# EAGLE design PCB-BI8-2x4C3 (EAGLE 7.5.0)

## Sheet 1 of 2
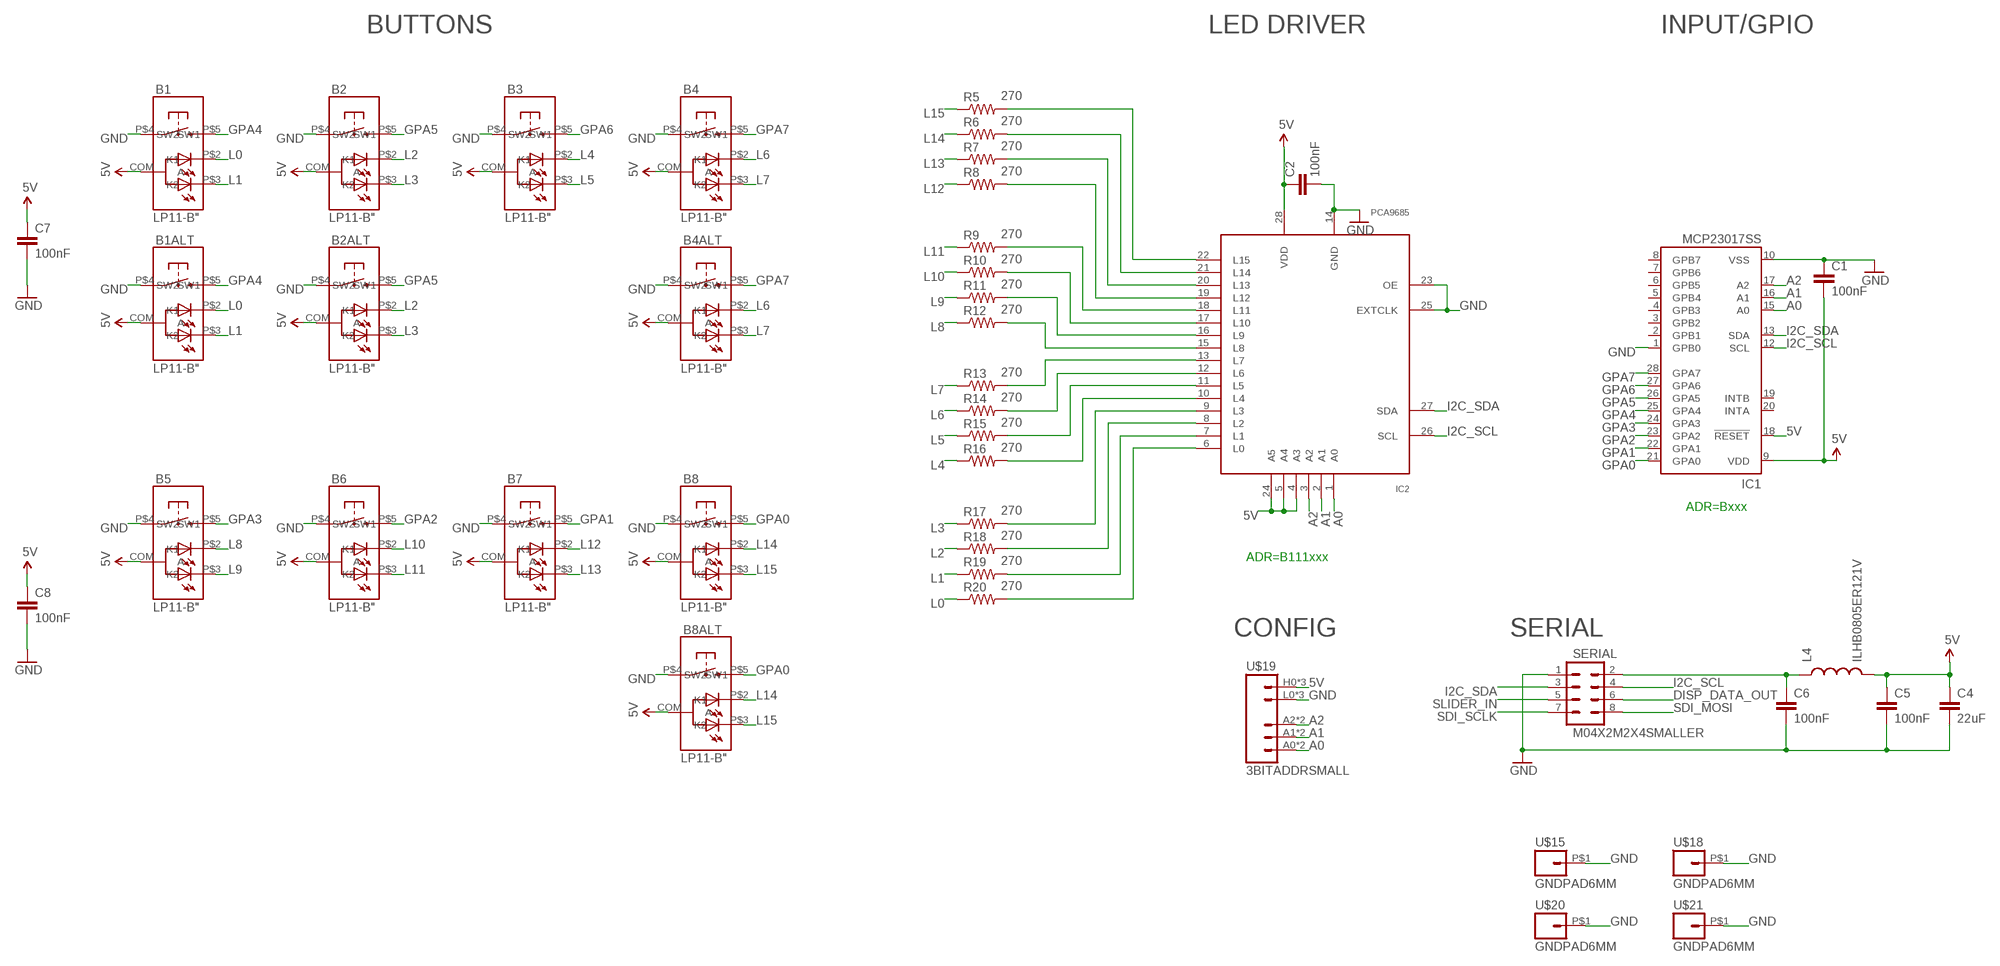
[diagram p0: schematic, sheet 1]

### Parts
B1  LP11-B"  [LP11]
B1ALT  LP11-B"  [LP11]
B2  LP11-B"  [LP11]
B2ALT  LP11-B"  [LP11]
B3  LP11-B"  [LP11]
B4  LP11-B"  [LP11]
B4ALT  LP11-B"  [LP11]
B5  LP11-B"  [LP11]
B6  LP11-B"  [LP11]
B7  LP11-B"  [LP11]
B8  LP11-B"  [LP11]
B8ALT  LP11-B"  [LP11]
C1  100nF  CAP0603-CAP  [0603-CAP]
C2  100nF  CAP0603-CAP  [0603-CAP]
C4  22uF  CAP0805  [0805]
C5  100nF  CAP0603-CAP  [0603-CAP]
C6  100nF  CAP0603-CAP  [0603-CAP]
C7  100nF  CAP0603-CAP  [0603-CAP]
C8  100nF  CAP0603-CAP  [0603-CAP]
IC1  MCP23017SS  [SSOP28]
IC2  PCA9685  [TSSOP28]
L4  ILHB0805ER121V  INDUCTOR0805  [0805]
R5  270  RESISTOR0603-RES  [0603-RES]
R6  270  RESISTOR0603-RES  [0603-RES]
R7  270  RESISTOR0603-RES  [0603-RES]
R8  270  RESISTOR0603-RES  [0603-RES]
R9  270  RESISTOR0603-RES  [0603-RES]
R10  270  RESISTOR0603-RES  [0603-RES]
R11  270  RESISTOR0603-RES  [0603-RES]
R12  270  RESISTOR0603-RES  [0603-RES]
R13  270  RESISTOR0603-RES  [0603-RES]
R14  270  RESISTOR0603-RES  [0603-RES]
R15  270  RESISTOR0603-RES  [0603-RES]
R16  270  RESISTOR0603-RES  [0603-RES]
R17  270  RESISTOR0603-RES  [0603-RES]
R18  270  RESISTOR0603-RES  [0603-RES]
R19  270  RESISTOR0603-RES  [0603-RES]
R20  270  RESISTOR0603-RES  [0603-RES]
SERIAL  M04X2M2X4SMALLER  [M2X4SMALLER]
U$15  GNDPAD6MM  [3.2MMPAD6MM]
U$18  GNDPAD6MM  [3.2MMPAD6MM]
U$19  3BITADDRSMALL  [3BITADDR_SMALL]
U$20  GNDPAD6MM  [3.2MMPAD6MM]
U$21  GNDPAD6MM  [3.2MMPAD6MM]

### Nets
5V [Power]: B1.COM(A) B1ALT.COM(A) B2.COM(A) B2ALT.COM(A) B3.COM(A) B4.COM(A) B4ALT.COM(A) B5.COM(A) B6.COM(A) B7.COM(A) B8.COM(A) B8ALT.COM(A) C1.2 C2.1 C4.1 C5.1 C7.1 C8.1 IC1.9(VDD) IC1.18(!RESET) IC2.4(A3) IC2.5(A4) IC2.24(A5) IC2.28(VDD) L4.2 U$19.H0(VCC) U$19.H1(VCC) U$19.H2(VCC)
A0: IC1.15(A0) IC2.1(A0) U$19.A0 U$19.AS0(A0)
A1: IC1.16(A1) IC2.2(A1) U$19.A1 U$19.AS1(A1)
A2: IC1.17(A2) IC2.3(A2) U$19.A2 U$19.AS2(A2)
DISP_DATA_OUT: SERIAL.6
GND [Power]: B1.P$4(SW1) B1ALT.P$4(SW1) B2.P$4(SW1) B2ALT.P$4(SW1) B3.P$4(SW1) B4.P$4(SW1) B4ALT.P$4(SW1) B5.P$4(SW1) B6.P$4(SW1) B7.P$4(SW1) B8.P$4(SW1) B8ALT.P$4(SW1) C1.1 C2.2 C4.2 C5.2 C6.2 C7.2 C8.2 IC1.1(GPB0) IC1.10(VSS) IC2.14(GND) IC2.23(OE) IC2.25(EXTCLK) SERIAL.1 U$15.P$1 U$18.P$1 U$19.L0(GND) U$19.L1(GND) U$19.L2(GND) U$20.P$1 U$21.P$1
GPA0: B8.P$5(SW2) B8ALT.P$5(SW2) IC1.21(GPA0)
GPA1: B7.P$5(SW2) IC1.22(GPA1)
GPA2: B6.P$5(SW2) IC1.23(GPA2)
GPA3: B5.P$5(SW2) IC1.24(GPA3)
GPA4: B1.P$5(SW2) B1ALT.P$5(SW2) IC1.25(GPA4)
GPA5: B2.P$5(SW2) B2ALT.P$5(SW2) IC1.26(GPA5)
GPA6: B3.P$5(SW2) IC1.27(GPA6)
GPA7: B4.P$5(SW2) B4ALT.P$5(SW2) IC1.28(GPA7)
I2C_SCL: IC1.12(SCL) IC2.26(SCL) SERIAL.4
I2C_SDA: IC1.13(SDA) IC2.27(SDA) SERIAL.3
L0: B1.P$2(K1) B1ALT.P$2(K1) R20.1
L1: B1.P$3(K2) B1ALT.P$3(K2) R19.1
L2: B2.P$2(K1) B2ALT.P$2(K1) R18.1
L3: B2.P$3(K2) B2ALT.P$3(K2) R17.1
L4: B3.P$2(K1) R16.1
L5: B3.P$3(K2) R15.1
L6: B4.P$2(K1) B4ALT.P$2(K1) R14.1
L7: B4.P$3(K2) B4ALT.P$3(K2) R13.1
L8: B5.P$2(K1) R12.1
L9: B5.P$3(K2) R11.1
L10: B6.P$2(K1) R10.1
L11: B6.P$3(K2) R9.1
L12: B7.P$2(K1) R8.1
L13: B7.P$3(K2) R7.1
L14: B8.P$2(K1) B8ALT.P$2(K1) R6.1
L15: B8.P$3(K2) B8ALT.P$3(K2) R5.1
N$1 [Power]: C6.1 L4.1 SERIAL.2
N$4: IC2.13(L7) R13.2
N$5: IC2.12(L6) R14.2
N$7: IC2.11(L5) R15.2
N$9: IC2.10(L4) R16.2
N$10: IC2.9(L3) R17.2
N$11: IC2.8(L2) R18.2
N$12: IC2.7(L1) R19.2
N$19: IC2.6(L0) R20.2
N$20: IC2.15(L8) R12.2
N$21: IC2.16(L9) R11.2
N$22: IC2.17(L10) R10.2
N$23: IC2.18(L11) R9.2
N$24: IC2.19(L12) R8.2
N$25: IC2.20(L13) R7.2
N$26: IC2.21(L14) R6.2
N$27: IC2.22(L15) R5.2
SDI_MOSI: SERIAL.8
SDI_SCLK: SERIAL.7
SLIDER_IN: SERIAL.5
Unconnected: IC1.2(GPB1) IC1.3(GPB2) IC1.4(GPB3) IC1.5(GPB4) IC1.6(GPB5) IC1.7(GPB6) IC1.8(GPB7) IC1.19(INTB) IC1.20(INTA)

### Notes on the sheet
- BUTTONS | LED DRIVER | INPUT/GPIO
- ADR=Bxxx
- ADR=B111xxx
- CONFIG | SERIAL

## Sheet 2 of 2

## Library data of the parts
B1 B1ALT B2 B2ALT B3 B4 B4ALT B5-B8 B8ALT = SKAARHOJ:LP11-B
C1 C2 C4-C8 = SparkFun:CAP: Capacitor Standard 0603 ceramic capacitor, and 0.1" leaded capacitor.
IC1 = microchip:MCP23017: http://ww1.microchip.com/downloads/en/DeviceDoc/21952a.pdf Source: http://ww1.microchip.com/downloads/en/DeviceDoc/21952a.pdf; MF: MICROCHIP; MPN: MCP23017-E/SS; OC_FARNELL: 1467674; OC_NEWARK: 31K2960
IC2 = wsmith:PCA9685
L4 = SparkFun:INDUCTOR: Inductors Basic Inductor/Choke - 0603 and 1206. Footprints are not proven and vary greatly between part numbers.
R5-R20 = SparkFun:RESISTOR: Resistor Basic schematic elements and footprints for 0603, 1206, and PTH resistors.
SERIAL = SKAARHOJ:M04X2
U$15 U$18 U$20 U$21 = SKAARHOJ:GNDPAD
U$19 = SKAARHOJ:3BITADDR

## Net classes
0 default: width 0.203 mm, drill 0.406 mm, clearance 0.203 mm
1 Power: width 0.406 mm, drill 0.61 mm, clearance 0.203 mm

## Board
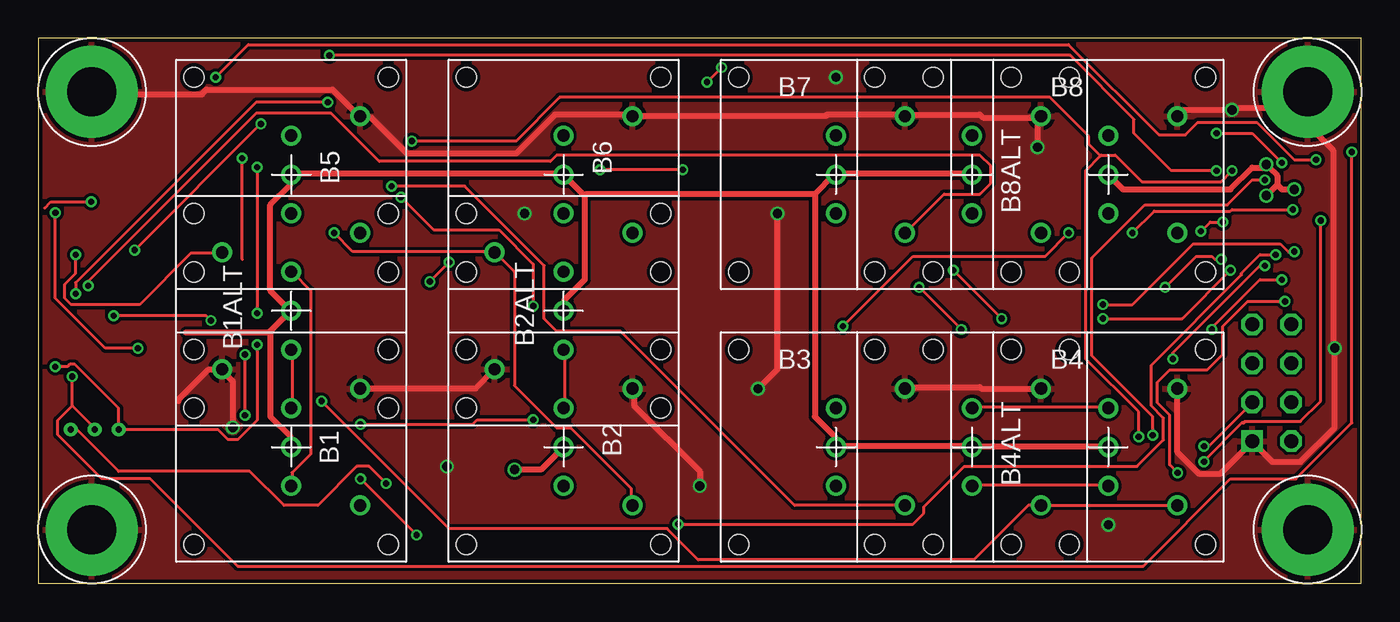
[diagram p1: board, top side]
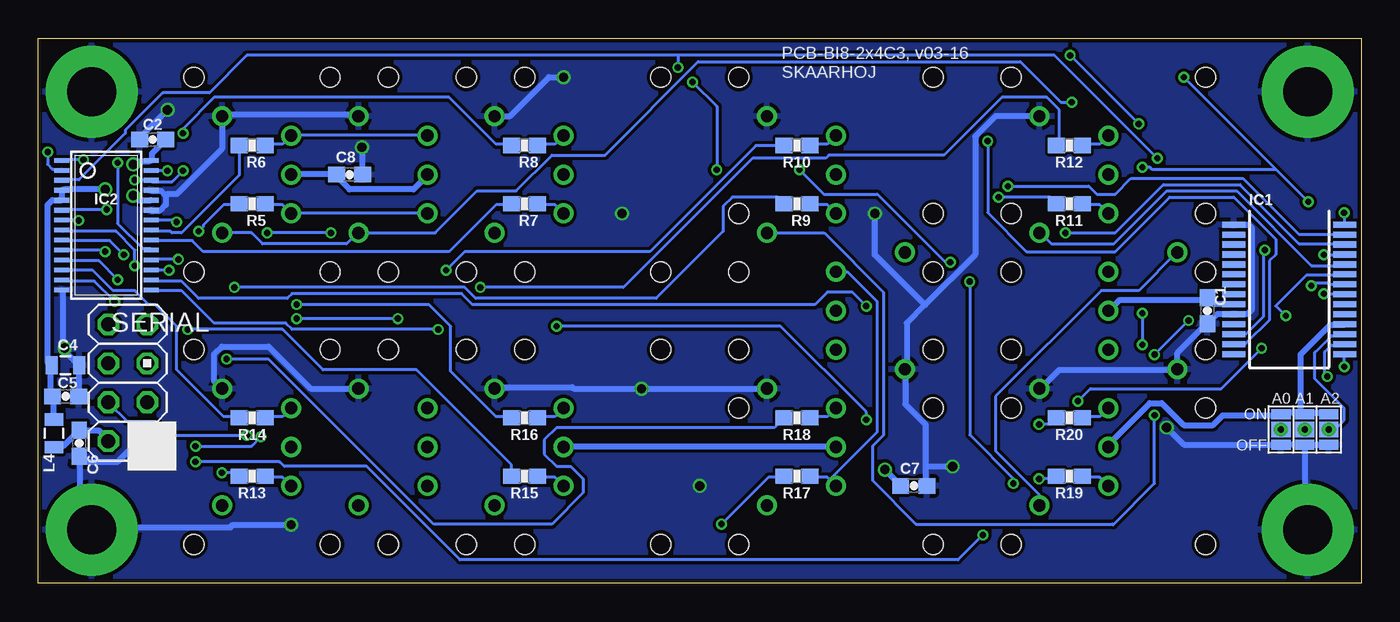
[diagram p2: board, bottom side, seen from below]

Size 86.36 x 35.56 mm. Coordinates in mm from the lower left corner, seen from the top.
Outline: 0,0 86.36,0 86.36,35.56 0,35.56 0,0
Copper layers (1*16): Top 0.035mm / dielectric 1.5mm / Bottom 0.035mm
Design rules "Fusion_eagle_rule_v1.1": minimum track width 6mil, minimum drill 12mil, track to track 6mil, track to pad 6mil, pad to pad 6mil, via to via 6mil, smd to smd 0mil, copper to edge 10mil, drill to drill 10mil, minimum pad ring 10mil, minimum via ring 6mil, stop-mask expansion 2mil, vias tented up to drill 100mil, thermal gap 10mil

### Footprints (pad centres in the part's own frame; a part is rotated, then mirrored left to right if it is on the bottom)
LP11 = drill 0.8: COM 0,0; P$2 0,2.54; P$3 0,-2.54; P$4 4.5,3.81; P$5 4.5,-3.81 | hole 1.3: -6.35,6.35; 6.35,6.35; 6.35,-6.35; -6.35,-6.35
0603-CAP = smd 1.1 x 1: 1 -0.85,0; 2 0.85,0
0805 = smd 0.8 x 1.2: 1 -0.9,0; 2 0.9,0
SSOP28 = smd 0.4 x 1.5: 1 -4.225,-3.625; 2 -3.575,-3.625; 3 -2.925,-3.625; 4 -2.275,-3.625; 5 -1.625,-3.625; 6 -0.975,-3.625; 7 -0.325,-3.625; 8 0.325,-3.625; 9 0.975,-3.625; 10 1.625,-3.625; 11 2.275,-3.625; 12 2.925,-3.625; 13 3.575,-3.625; 14 4.225,-3.625; 15 4.225,3.625; 16 3.575,3.625; 17 2.925,3.625; 18 2.275,3.625; 19 1.625,3.625; 20 0.975,3.625; 21 0.325,3.625; 22 -0.325,3.625; 23 -0.975,3.625; 24 -1.625,3.625; 25 -2.275,3.625; 26 -2.925,3.625; 27 -3.575,3.625; 28 -4.225,3.625
TSSOP28 = smd 0.305 x 0.991: 1 -4.225,-2.918; 2 -3.575,-2.918; 3 -2.925,-2.918; 4 -2.275,-2.918; 5 -1.625,-2.918; 6 -0.975,-2.918; 7 -0.325,-2.918; 8 0.325,-2.918; 9 0.975,-2.918; 10 1.625,-2.918; 11 2.275,-2.918; 12 2.925,-2.918; 13 3.575,-2.918; 14 4.225,-2.918; 15 4.225,2.918; 16 3.575,2.918; 17 2.925,2.918; 18 2.275,2.918; 19 1.625,2.918; 20 0.975,2.918; 21 0.325,2.918; 22 -0.325,2.918; 23 -0.975,2.918; 24 -1.625,2.918; 25 -2.275,2.918; 26 -2.925,2.918; 27 -3.575,2.918; 28 -4.225,2.918
0603-RES = smd 1.1 x 1: 1 -0.85,0; 2 0.85,0
M2X4SMALLER = drill 0.9 square: 1 -1.27,3.81 | drill 0.9 octagon: 2 1.27,3.81; 3 -1.27,1.27; 4 1.27,1.27; 5 -1.27,-1.27; 6 1.27,-1.27; 7 -1.27,-3.81; 8 1.27,-3.81
3.2MMPAD6MM = drill 3.2 pad 6: P$1 0,0
3BITADDR_SMALL = drill 0.4: A0 -1.565,0; A1 0,0; A2 1.565,0 | smd 1.27 x 1: AS0 -1.565,0; AS1 0,0; AS2 1.565,0 | smd 1.27 x 0.635: H0 -1.565,1; H1 0,1; H2 1.565,1; L0 -1.565,-1; L1 0,-1; L2 1.565,-1

### Placement (x,y rotation side)
B1  16.51,8.89 0 top
B1ALT  16.51,17.78 180 top
B2  34.29,8.89 0 top
B2ALT  34.29,17.78 180 top
B3  52.07,8.89 0 top
B4  69.85,8.89 0 top
B4ALT  60.96,8.89 0 top
B5  16.51,26.67 0 top
B6  34.29,26.67 0 top
B7  52.07,26.67 0 top
B8  69.85,26.67 0 top
B8ALT  60.96,26.67 0 top
C1  10.03,17.78 90 bottom
C2  78.89,28.96 180 bottom
C4  84.58,14.22 0 bottom
C5  84.58,12.19 0 bottom
C6  83.69,9.14 270 bottom
C7  29.21,6.35 0 bottom
C8  66.04,26.67 0 bottom
IC1  4.7,19.18 270 bottom
IC2  81.92,23.37 270 bottom
L4  85.34,9.78 90 bottom
R5  72.39,24.77 180 bottom
R6  72.39,28.57 180 bottom
R7  54.61,24.77 180 bottom
R8  54.61,28.57 180 bottom
R9  36.83,24.77 180 bottom
R10  36.83,28.57 180 bottom
R11  19.05,24.77 180 bottom
R12  19.05,28.57 180 bottom
R13  72.39,6.99 180 bottom
R14  72.39,10.79 180 bottom
R15  54.61,6.99 180 bottom
R16  54.61,10.79 180 bottom
R17  36.83,6.99 180 bottom
R18  36.83,10.79 180 bottom
R19  19.05,6.99 180 bottom
R20  19.05,10.79 180 bottom
SERIAL  80.52,13.08 180 bottom
U$15  3.5,3.5 0 top
U$18  82.86,3.5 0 top
U$19  3.68,10.03 0 bottom
U$20  3.5,32.06 0 top
U$21  82.86,32.06 0 top

### Tracks (layer width: path | path; a pad name or v marks a point on that pad's centre or on a via)
5V  (via drill 0.61)
  Top 0.406: v31.09,7.42 32.82,7.42 B2.COM | B4.COM 69.8,8.94 61.06,8.94 B4ALT.COM 60.96,8.94 52.12,8.94 B3.COM 52.02,9.04 52.02,9.55 50.7,10.87 50.7,25.4 | 15.14,16.36 15.14,16.46 16.46,17.78 B1ALT.COM 16.36,17.88 15.14,19.1 15.14,24.69 16.46,26.01 16.46,26.62 B5.COM 16.66,26.72 34.14,26.72 B6.COM 35.66,25.3 | 15.14,16.36 15.14,10.87 16.46,9.55 16.46,8.94 B1.COM | 15.14,16.36 9.65,16.36 | 80.87,26.01 v80.16,25.3 | 80.87,26.01 80.87,26.62 80.37,27.13 80.16,27.13 | 80.16,27.13 79.25,27.13 77.83,25.7 70.81,25.7 B8.COM | v80.16,27.33 80.16,27.13 | v81.99,25.7 81.18,25.7 80.87,26.01 | 35.66,25.3 35.66,19.81 34.34,18.49 34.34,17.78 B2ALT.COM | B8ALT.COM 60.96,26.72 52.12,26.72 B7.COM 51.92,26.62 50.7,25.4 | 50.7,25.4 35.76,25.4 35.66,25.3
  Bottom 0.406: IC1.9 9.61,18.2 C1.2 10.16,18.49 15.75,18.49 16.46,17.78 B1ALT.COM | v31.09,7.42 30.07,6.4 C7.1 | B2.COM 34.34,8.94 52.02,8.94 B3.COM | IC1.18 1.12,16.87 2.03,16.87 3.86,15.04 3.97,14.92 3.97,11.27 U$19.H1 | L4.2 85.34,12.19 C5.1 85.55,12.29 85.55,14.22 C4.1 85.65,14.33 85.75,14.43 85.75,24.69 85.45,24.99 85.04,24.99 IC2.5 84.84,25.6 IC2.4 84.63,25.7 v81.99,25.7 | C2.1 78.03,28.96 78.94,28.04 78.94,27.64 IC2.28 79.15,27.53 79.96,27.53 v80.16,27.33 | v80.16,25.3 79.86,24.99 79.05,24.99 IC2.24 | B8.COM 69.8,26.72 66.95,26.72 C8.1 66.85,26.52 66.04,25.7 61.87,25.7 60.96,26.62 B8ALT.COM | U$19.H2 2.22,11.11 3.65,11.11 U$19.H1 | U$19.H1 3.81,11.11 5.24,11.11 U$19.H0 5.4,10.95 9.05,10.95 9.68,10.32 11.59,10.32 13.02,11.75 13.81,11.75 16.51,9.05 B1.COM
A0  (via drill 0.41)
  Top 0.203: v83.41,27.64 81.99,27.64 79.55,30.07 75.69,30.07 74.88,29.26 73.15,29.26 67.26,35.15 13.72,35.15 v11.58,33.02 | v3.45,24.89 0.81,24.89 0.41,24.49 | v1.11,14.13 1.91,14.13 2.06,14.29 2.38,14.29 5.24,11.43 5.24,10.16 U$19.AS0 5.4,10 11.75,10 12.38,9.37 13.02,9.37 14.29,10.64 v14.29,15.56 | v14.29,27.15 v14.29,17.62
  Bottom 0.203: v83.41,27.64 84.73,27.64 IC2.1 | v3.45,24.89 5.55,26.99 | 5.55,26.99 v11.58,33.02 | 1.02,14.94 IC1.15 1.11,14.92 v1.11,14.13 | 5.4,10 U$19.AS0 | v14.29,17.62 v14.29,15.56 | v14.29,27.15 13.81,27.15 13.65,26.99 5.56,26.99 5.55,26.99
A1  (via drill 0.41)
  Top 0.203: v85.75,28.14 85.75,10.46 82.09,6.81 77.83,6.81 72.14,1.12 13.02,1.12 | 13.01,1.12 13.02,1.12 | 2.22,11.59 v2.22,13.49 | 2.22,11.59 3.65,10.16 U$19.AS1 | 2.22,11.59 1.27,10.64 1.27,9.68 4.13,6.83 7.3,6.83 13.02,1.11 13.02,1.12
  Bottom 0.203: v85.75,28.14 85.75,27.33 85.45,27.03 84.84,27.03 IC2.2 | IC1.16 1.12,15.54 1.93,15.54 2.34,15.14 2.38,15.08 2.38,13.65 v2.22,13.49 | 3.81,10 U$19.AS1
A2  (via drill 0.41)
  Top 0.203: 13.31,21.13 v13.31,27.74 | v22.7,6.51 21.59,7.62 20.8,7.62 18.26,5.08 16.03,5.08 13.81,7.3 5.24,7.3 2.54,10 2.22,10 U$19.AS2 | v26.83,20.95 v25.56,19.68 | v42.07,26.99 v36.67,26.99 | v44.61,33.66 v43.66,32.7
  Bottom 0.203: 44.61,34.44 20.02,34.44 v13.31,27.74 | 44.61,34.44 72.75,34.44 75.18,32 78.23,32 80.67,29.57 80.67,29.36 83.72,26.31 84.73,26.31 IC2.3 | 3.05,15.04 3.01,15.07 | 3.01,15.07 1.93,16.15 1.12,16.15 IC1.17 | 2.22,10 U$19.AS2 2.06,10.16 1.59,10.16 1.11,10.64 1.11,11.43 3.02,13.34 3.02,15.08 3.01,15.07 | v22.7,6.51 22.7,6.83 25.56,9.68 v25.56,19.68 | v26.83,20.95 27.15,20.95 31.59,25.4 35.08,25.4 v36.67,26.99 | v42.07,26.99 42.07,31.11 v43.66,32.7 | 44.61,34.44 v44.61,33.66 | 44.61,34.45 44.61,34.44
GND  (via drill 0.6, 0.61)
  Top 0.406: B4ALT.P$4 61.57,12.7 61.47,12.8 56.69,12.8 56.59,12.7 B3.P$4 | B4.P$4 74.37,12.7 74.37,8.53 75.79,7.11 77.11,7.11 79.25,9.25 SERIAL.1 79.35,9.14 80.57,7.92 82.4,7.92 84.63,10.16 v84.63,15.34 84.53,15.44 84.53,28.25 81.89,30.89 U$21.P$1 81.79,30.99 78.03,30.99 v77.93,30.89 74.78,30.89 74.37,30.48 B8.P$4 | B1.P$4 28.55,12.7 29.77,13.92 B2ALT.P$4 | 9.14,11.89 9.14,11.99 11.07,13.92 11.99,13.92 B1ALT.P$4 12.06,13.81 12.7,13.18 v12.7,10.16 | U$20.P$1 3.66,31.9 10.67,31.9 10.97,32.21 19.2,32.21 20.93,30.48 B5.P$4 21.13,30.38 21.74,30.38 24.08,28.04 31.19,28.04 33.73,30.58 38.61,30.58 B6.P$4 51.41,30.48 51.51,30.58 56.39,30.58 56.49,30.48 B7.P$4 56.69,30.58 61.47,30.58 61.67,30.38 65.13,30.38 B8ALT.P$4 65.43,30.48 65.23,30.28 v65.23,28.45 | v43.18,6.35 43.18,7.3 38.89,11.59 38.89,12.7 B2.P$4 | v48.26,24.13 48.26,13.97 v46.99,12.7
  Bottom 0.406: B2.P$4 v46.99,12.7 51.41,12.7 51.51,12.8 56.39,12.8 56.49,12.7 B3.P$4 | 84.73,15.34 84.73,15.24 83.72,14.22 C4.2 83.72,14.12 83.72,12.19 C5.2 | 84.73,15.34 84.73,19.1 IC2.14 | v84.63,15.34 84.73,15.34 | SERIAL.1 79.25,9.25 79.86,9.25 81.18,7.92 83.52,7.92 C6.2 83.62,8.23 83.62,4.27 82.91,3.56 U$18.P$1 82.71,3.65 73.82,3.65 73.66,3.81 v69.85,3.81 | B4ALT.P$4 68.58,12.7 71.32,15.44 74.37,15.44 74.88,14.94 74.88,13.21 74.37,12.7 B4.P$4 | 3.56,3.56 U$15.P$1 3.65,3.65 3.65,8.89 U$19.L1 | IC1.1 8.23,23.37 7.32,23.37 7.11,23.16 7.11,17.88 7.42,17.58 8.13,17.58 IC1.10 9.41,17.55 C1.1 10.16,16.87 11.99,15.04 11.99,14.02 B1ALT.P$4 12.19,13.92 19.71,13.92 20.93,12.7 B1.P$4 | 28.45,7.62 28.45,10.36 29.77,11.68 29.77,13.92 B2ALT.P$4 29.67,14.12 29.67,16.97 28.48,18.16 | 28.45,7.62 28.45,6.4 C7.2 | 78.03,25.3 78.03,24.69 78.44,24.28 78.94,24.28 IC2.23 | 78.03,25.3 78.33,25.6 78.94,25.6 IC2.25 | v77.93,30.89 79.65,29.16 79.65,28.96 C2.2 | 78.03,25.3 77.93,25.4 77.32,25.4 74.37,28.35 74.37,30.48 B8.P$4 74.17,30.58 65.63,30.58 65.53,30.48 B8ALT.P$4 | v65.23,28.45 65.23,26.72 C8.2 | 28.48,18.16 25.2,21.44 25.2,29.16 23.88,30.48 B5.P$4 | U$19.L2 2.22,9.05 3.65,9.05 U$19.L1 | U$19.L1 3.81,9.05 5.24,9.05 U$19.L0 5.4,9.05 11.59,9.05 v12.7,10.16 | 28.45,7.62 v26.67,7.62 | v31.75,24.13 31.75,21.43 28.48,18.16 | v52.07,33.02 53.02,33.02 55.56,30.48 B7.P$4
  pour Top: 0,0 86.36,0 86.36,35.56 0,35.56
  pour Bottom: 0,0 86.36,0 86.36,35.56 0,35.56
GPA0  (via drill 0.41)
  Top 0.203: v2.44,18.9 2.44,19.61 14.22,31.39 v18.9,31.39
  Bottom 0.203: v2.44,18.9 1.12,18.9 IC1.21 | v18.9,31.39 19.61,31.39 22.25,34.04 43.28,34.04 49.38,27.94 52.83,27.94 55.17,25.6 57.71,25.6 60.45,22.86 B8ALT.P$5 65.53,22.86 66.24,22.15 71.73,22.15 72.44,22.86 B8.P$5
GPA1  (via drill 0.41)
  Top 0.203: v3.25,19.41 3.25,19.71 14.22,30.68 19.1,30.68 22.25,27.53 33.43,27.53 33.83,27.94 61.47,27.94 62.18,27.23 62.18,26.11 61.47,25.4 59.13,25.4 56.59,22.86 B7.P$5
  Bottom 0.203: v3.25,19.41 3.05,19.61 2.13,19.61 2.03,19.51 1.12,19.51 IC1.22
GPA2  (via drill 0.41)
  Top 0.203: v4.92,17.46 10.95,17.46 v11.27,17.14 | v13.49,10.95 v13.49,14.92
  Bottom 0.203: 5.59,18.09 5.57,18.11 | 5.57,18.11 3.56,20.12 1.12,20.12 IC1.23 | B6.P$5 35.05,22.86 31.19,19 31.19,9.65 31.9,8.94 31.9,6.71 29.06,3.86 16.26,3.86 16.19,3.81 13.49,6.51 v13.49,10.95 | v4.92,17.46 5.57,18.11 | v13.49,14.92 v11.27,17.14
GPA3
  Bottom 0.203: IC1.24 1.12,20.73 3.25,20.73 8.13,25.6 12.7,25.6 16.15,22.15 20.22,22.15 20.93,22.86 B5.P$5
GPA4  (via drill 0.41)
  Top 0.203: v2.44,21.44 2.44,20.22 1.73,19.51 1.73,18.59 2.13,18.19 6.6,18.19 9.96,21.54 11.99,21.54 B1ALT.P$5
  Bottom 0.203: v2.44,21.44 1.12,21.44 IC1.25 | B1.P$5 21.03,5.08 21.03,5.79 23.88,8.64 23.88,12.19 16.97,19.1 14.53,19.1 12.09,21.54 B1ALT.P$5
GPA5  (via drill 0.41)
  Top 0.203: v19.3,22.86 20.52,21.64 29.77,21.64 B2ALT.P$5 29.87,21.54 31.09,20.32 31.09,12.9 33.83,10.16 34.75,10.16 38.71,6.2 38.71,5.08 B2.P$5
  Bottom 0.203: v19.3,22.86 16.05,22.86 12.9,26.01 7.92,26.01 4.06,22.15 1.12,22.15 IC1.26
GPA6  (via drill 0.41)
  Top 0.203: v23.06,25.91 27.84,25.91 33.02,20.73 33.02,17.27 33.83,16.46 38,16.46 49.38,5.08 B3.P$5
  Bottom 0.203: v23.06,25.91 17.78,25.91 17.27,25.4 16.05,25.4 15.04,26.42 7.72,26.42 4.06,22.76 1.12,22.76 IC1.27
GPA7  (via drill 0.41)
  Top 0.203: v1.12,24.18 1.12,18.59 4.37,15.34 v6.5,15.34 | v18.49,11.89 26.82,3.56 41.05,3.56 43.08,1.52 61.06,1.52 64.62,5.08 B4ALT.P$5 B4.P$5
  Bottom 0.203: v1.12,24.18 1.12,23.47 IC1.28 | v6.5,15.34 9.14,12.7 17.68,12.7 v18.49,11.89
I2C_SCL  (via drill 0.41)
  Top 0.203: v80.06,26.31 79.25,26.31 77.62,24.69 72.24,24.69 68.78,21.23 68.78,14.83 72.75,10.87 v72.75,9.65 | v14.53,29.97 v6.3,21.74 | v19,34.44 67.36,34.44 71.53,30.28 71.53,29.36 73.97,26.92 v76.91,26.92
  Bottom 0.203: v80.06,26.31 79.05,26.31 IC2.26 78.94,26.21 77.62,26.21 v76.91,26.92 | 77.83,9.65 77.79,9.65 | 77.79,9.65 v72.75,9.65 | SERIAL.4 81.79,11.79 80.57,10.57 78.74,10.57 78.74,10.48 78.58,10.48 77.79,9.68 77.79,9.65 | v6.3,21.74 6.4,21.64 6.4,17.37 7.52,16.26 8.23,16.26 IC1.12 | v19,34.44 v14.53,29.97
I2C_SDA  (via drill 0.41)
  Top 0.203: v77.93,26.92 77.22,26.21 72.03,26.21 70.31,27.94 69.39,27.94 69.34,27.89 | 69.34,27.89 68.38,26.92 68.38,14.63 71.83,11.18 v71.83,9.55 | v76.1,8.94 76.4,8.94 79.25,11.79 SERIAL.3 | v24.38,28.85 31.19,28.85 34.04,31.7 66.04,31.7 68.58,29.16 68.58,28.65 69.34,27.89
  Bottom 0.203: v77.93,26.92 78.94,26.92 IC2.27 | v71.83,9.55 72.44,8.94 v76.1,8.94 | v24.38,28.85 24.38,24.18 21.84,21.64 16.05,21.64 12.5,25.2 8.33,25.2 5.59,22.45 5.59,21.44 5.99,21.03 5.99,17.17 7.52,15.65 8.23,15.65 IC1.13
L0
  Top 0.203: B1.P$2 16.56,11.48 16.56,15.24 B1ALT.P$2
  Bottom 0.203: B1.P$2 17.07,10.87 18.19,10.87 R20.1
L1
  Top 0.203: B1.P$3 16.56,6.4 16.56,7.21 17.78,8.43 17.78,19.1 16.56,20.32 B1ALT.P$3
  Bottom 0.203: B1.P$3 17.07,6.91 18.19,6.91 R19.1
L2
  Top 0.203: B2.P$2 34.34,11.48 34.34,15.24 B2ALT.P$2
  Bottom 0.203: B2.P$2 34.85,10.87 35.97,10.87 R18.1
L3
  Bottom 0.203: R17.1 35.97,6.91 34.85,6.91 B2.P$3 34.65,6.81 31.6,9.86 31.6,18.39 33.53,20.32 B2ALT.P$3
L4
  Bottom 0.203: B3.P$2 52.63,10.87 53.75,10.87 R16.1
L5
  Bottom 0.203: B3.P$3 52.63,6.91 53.75,6.91 R15.1
L6
  Top 0.203: B4ALT.P$2 60.96,11.48 69.8,11.48 B4.P$2
  Bottom 0.203: B4.P$2 70.41,10.87 71.53,10.87 R14.1
L7
  Top 0.203: B4ALT.P$3 60.96,6.4 69.8,6.4 B4.P$3
  Bottom 0.203: B4.P$3 70.41,6.91 71.53,6.91 R13.1
L8
  Bottom 0.203: B5.P$2 17.07,28.65 18.19,28.65 R12.1
L9
  Bottom 0.203: B5.P$3 17.07,24.69 18.19,24.69 R11.1
L10
  Bottom 0.203: B6.P$2 34.85,28.65 35.97,28.65 R10.1
L11
  Bottom 0.203: B6.P$3 34.85,24.69 35.97,24.69 R9.1
L12
  Bottom 0.203: B7.P$2 52.63,28.65 53.75,28.65 R8.1
L13
  Bottom 0.203: B7.P$3 52.63,24.69 53.75,24.69 R7.1
L14
  Bottom 0.203: R6.1 71.53,28.65 70.41,28.65 B8.P$2 69.8,29.26 60.96,29.26 B8ALT.P$2
L15
  Bottom 0.203: R5.1 71.53,24.69 70.41,24.69 B8.P$3 69.8,24.18 60.96,24.18 B8ALT.P$3
N$1
  Bottom 0.406: SERIAL.2 81.79,9.35 82.4,9.96 83.62,9.96 C6.1 83.82,9.86 84.73,8.94 85.34,8.94 L4.1
N$4  (via drill 0.41)
  Top 0.203: v81.38,18.39 78.94,18.39 77.32,16.76 77.32,14.94 76.3,13.92 73.86,13.92 73.05,13.11 73.05,11.79 73.86,10.97 73.86,7.72 v74.37,7.21
  Bottom 0.203: v81.38,18.39 82.7,19.71 84.73,19.71 IC2.13 | v74.37,7.21 73.46,7.21 73.25,7.01 R13.2
N$5
  Bottom 0.203: IC2.12 84.73,20.42 82.8,20.42 81.48,19.1 80.06,19.1 79.15,18.19 78.74,18.19 77.32,16.76 77.32,13.92 74.27,10.87 73.25,10.87 R14.2
N$7  (via drill 0.41)
  Top 0.203: v81.18,19.81 79.76,19.81 76.61,16.66 v76.61,16.56
  Bottom 0.203: v81.18,19.81 82.4,21.03 84.73,21.03 IC2.11 | v76.61,16.56 70.41,16.56 67.77,13.92 61.67,13.92 55.47,7.72 55.47,7.01 R15.2
N$9  (via drill 0.41)
  Top 0.203: v81.99,21.64 81.58,21.64 81.08,22.15 75.39,22.15 71.42,18.19 v69.49,18.19
  Bottom 0.203: v81.99,21.64 82.09,21.74 84.73,21.74 IC2.10 | v69.49,18.19 60.86,18.19 59.44,16.76 59.44,13.82 56.49,10.87 55.47,10.87 R16.2
N$10  (via drill 0.41)
  Top 0.203: v80.77,21.44 79.76,21.44 78.54,20.22 78.54,20.12 72.64,14.22 72.64,11.58 73.46,10.77 73.46,9.35 71.73,7.62 60.45,7.62 57.81,4.98 57.81,4.57 57.1,3.86 v41.76,3.86
  Bottom 0.203: v80.77,21.44 81.69,22.35 84.73,22.35 IC2.9 | v41.76,3.86 38.71,6.91 37.69,6.91 R17.2
N$11  (via drill 0.41)
  Top 0.203: v80.06,20.73 79.76,20.73 74.07,15.04 v74.07,14.63
  Bottom 0.203: v80.06,20.73 80.06,21.74 81.28,22.96 84.73,22.96 IC2.8 | v74.07,14.63 71.32,14.63 60.55,3.86 52.83,3.86 50.8,5.89 50.8,6.81 51.61,7.62 52.53,7.62 53.34,8.43 53.34,9.35 52.53,10.16 38.3,10.16 37.69,10.77 R18.2
N$12  (via drill 0.41)
  Top 0.203: v83.72,23.67 83.72,11.89 82.4,10.57 78.74,10.57 78.74,10.48 78.58,10.48 76.04,7.94 v76.1,7.92 | v21.03,6.81 v24.69,3.15
  Bottom 0.203: v83.72,23.67 84.73,23.67 IC2.7 | v76.1,7.92 70.61,7.92 70.31,7.62 64.92,7.62 58.83,1.52 26.31,1.52 v24.69,3.15 | v21.03,6.81 20.02,6.81 19.91,6.91 R19.2
N$19  (via drill 0.41)
  Top 0.203: v81.89,24.38 77.93,24.38 77.83,24.28 72.85,24.28 v71.42,22.86 | v67.26,22.86 65.73,21.34 57.1,21.34 v52.53,16.76 | v32.31,10.67 28.65,10.67 28.35,10.36 v21.03,10.36
  Bottom 0.203: v81.89,24.38 84.73,24.38 IC2.6 | v67.26,22.86 v71.42,22.86 | v52.53,16.76 37.9,16.76 32.31,11.18 v32.31,10.67 | v21.03,10.36 20.32,10.36 19.91,10.77 R20.2
N$20  (via drill 0.41)
  Top 0.203: v57.51,19.3 v60.25,16.56
  Bottom 0.203: v60.25,16.56 69.8,16.56 70.21,16.97 74.88,16.97 77.01,19.1 78.94,19.1 IC2.15 | v57.51,19.3 48.16,19.3 39.73,27.74 34.95,27.74 34.75,27.94 27.23,27.94 23.47,31.7 20.52,31.7 19.71,30.89 19.71,28.75 19.81,28.65 R12.2
N$21  (via drill 0.41)
  Top 0.203: v32.31,18.09 32.31,20.83 30.07,23.06 25.81,23.06 v23.67,25.2
  Bottom 0.203: v32.31,18.09 33.22,19 34.85,19 35.66,18.19 58.01,18.19 58.73,18.9 69.8,18.9 70.1,18.59 75.89,18.59 77.01,19.71 78.94,19.71 IC2.16 | v23.67,25.2 20.32,25.2 19.91,24.79 R11.2
N$22  (via drill 0.41)
  Top 0.203: v77.83,20.42 74.68,17.27 v69.49,17.27 | v59.74,20.42 v62.89,17.27
  Bottom 0.203: v77.83,20.42 78.94,20.42 IC2.17 | v62.89,17.27 v69.49,17.27 | v59.74,20.42 58.52,21.64 46.43,21.64 39.52,28.55 37.69,28.55 R10.2
N$23  (via drill 0.41)
  Top 0.203: v77.22,21.13 76.81,21.13 76.61,21.34 75.59,21.34 v73.56,19.3
  Bottom 0.203: v77.22,21.13 78.94,21.13 IC2.18 | v73.56,19.3 58.52,19.3 57.81,18.59 46.02,18.59 41.66,22.96 41.66,24.59 41.05,25.2 38.1,25.2 37.69,24.79 R9.2
N$24  (via drill 0.41)
  Top 0.203: v81.18,27.43 79.25,29.36 v76.91,29.36
  Bottom 0.203: v81.18,27.43 81.18,23.47 79.55,21.84 79.05,21.84 IC2.19 | v76.91,29.36 76.91,29.67 74.88,31.7 59.54,31.7 56.49,28.65 55.47,28.65 R8.2
N$25
  Bottom 0.203: IC2.20 78.94,22.35 76.3,22.35 75.59,21.64 59.54,21.64 56.49,24.69 55.47,24.69 R7.2
N$26
  Bottom 0.203: IC2.21 78.94,22.96 77.72,22.96 77.62,22.86 77.01,22.86 73.25,26.62 73.25,28.55 R6.2
N$27  (via drill 0.41)
  Top 0.203: v77.32,23.57 76.5,23.57 v75.89,22.96
  Bottom 0.203: v77.32,23.57 77.42,23.67 78.94,23.67 IC2.22 | v75.89,22.96 75.59,23.27 75.59,23.37 74.27,24.69 73.25,24.69 R5.2

### Text on the board
_bsilk: PCB-BI8-2x4C3, v03-16 / SKAARHOJ